# Altium schematic sheet 04 - Auxiliary Power.SchDoc: Auxiliary Power - 25kW WolfPACK FM3 Six-Pack Inv. (part 1 of 3)
size 431 x 279 mm; Date: 09/2024; DocumentNumber: CRD25DA12N-FMC; Revision: 2.0; SheetNumber: 4; SheetTotal: 9; SheetSize: B
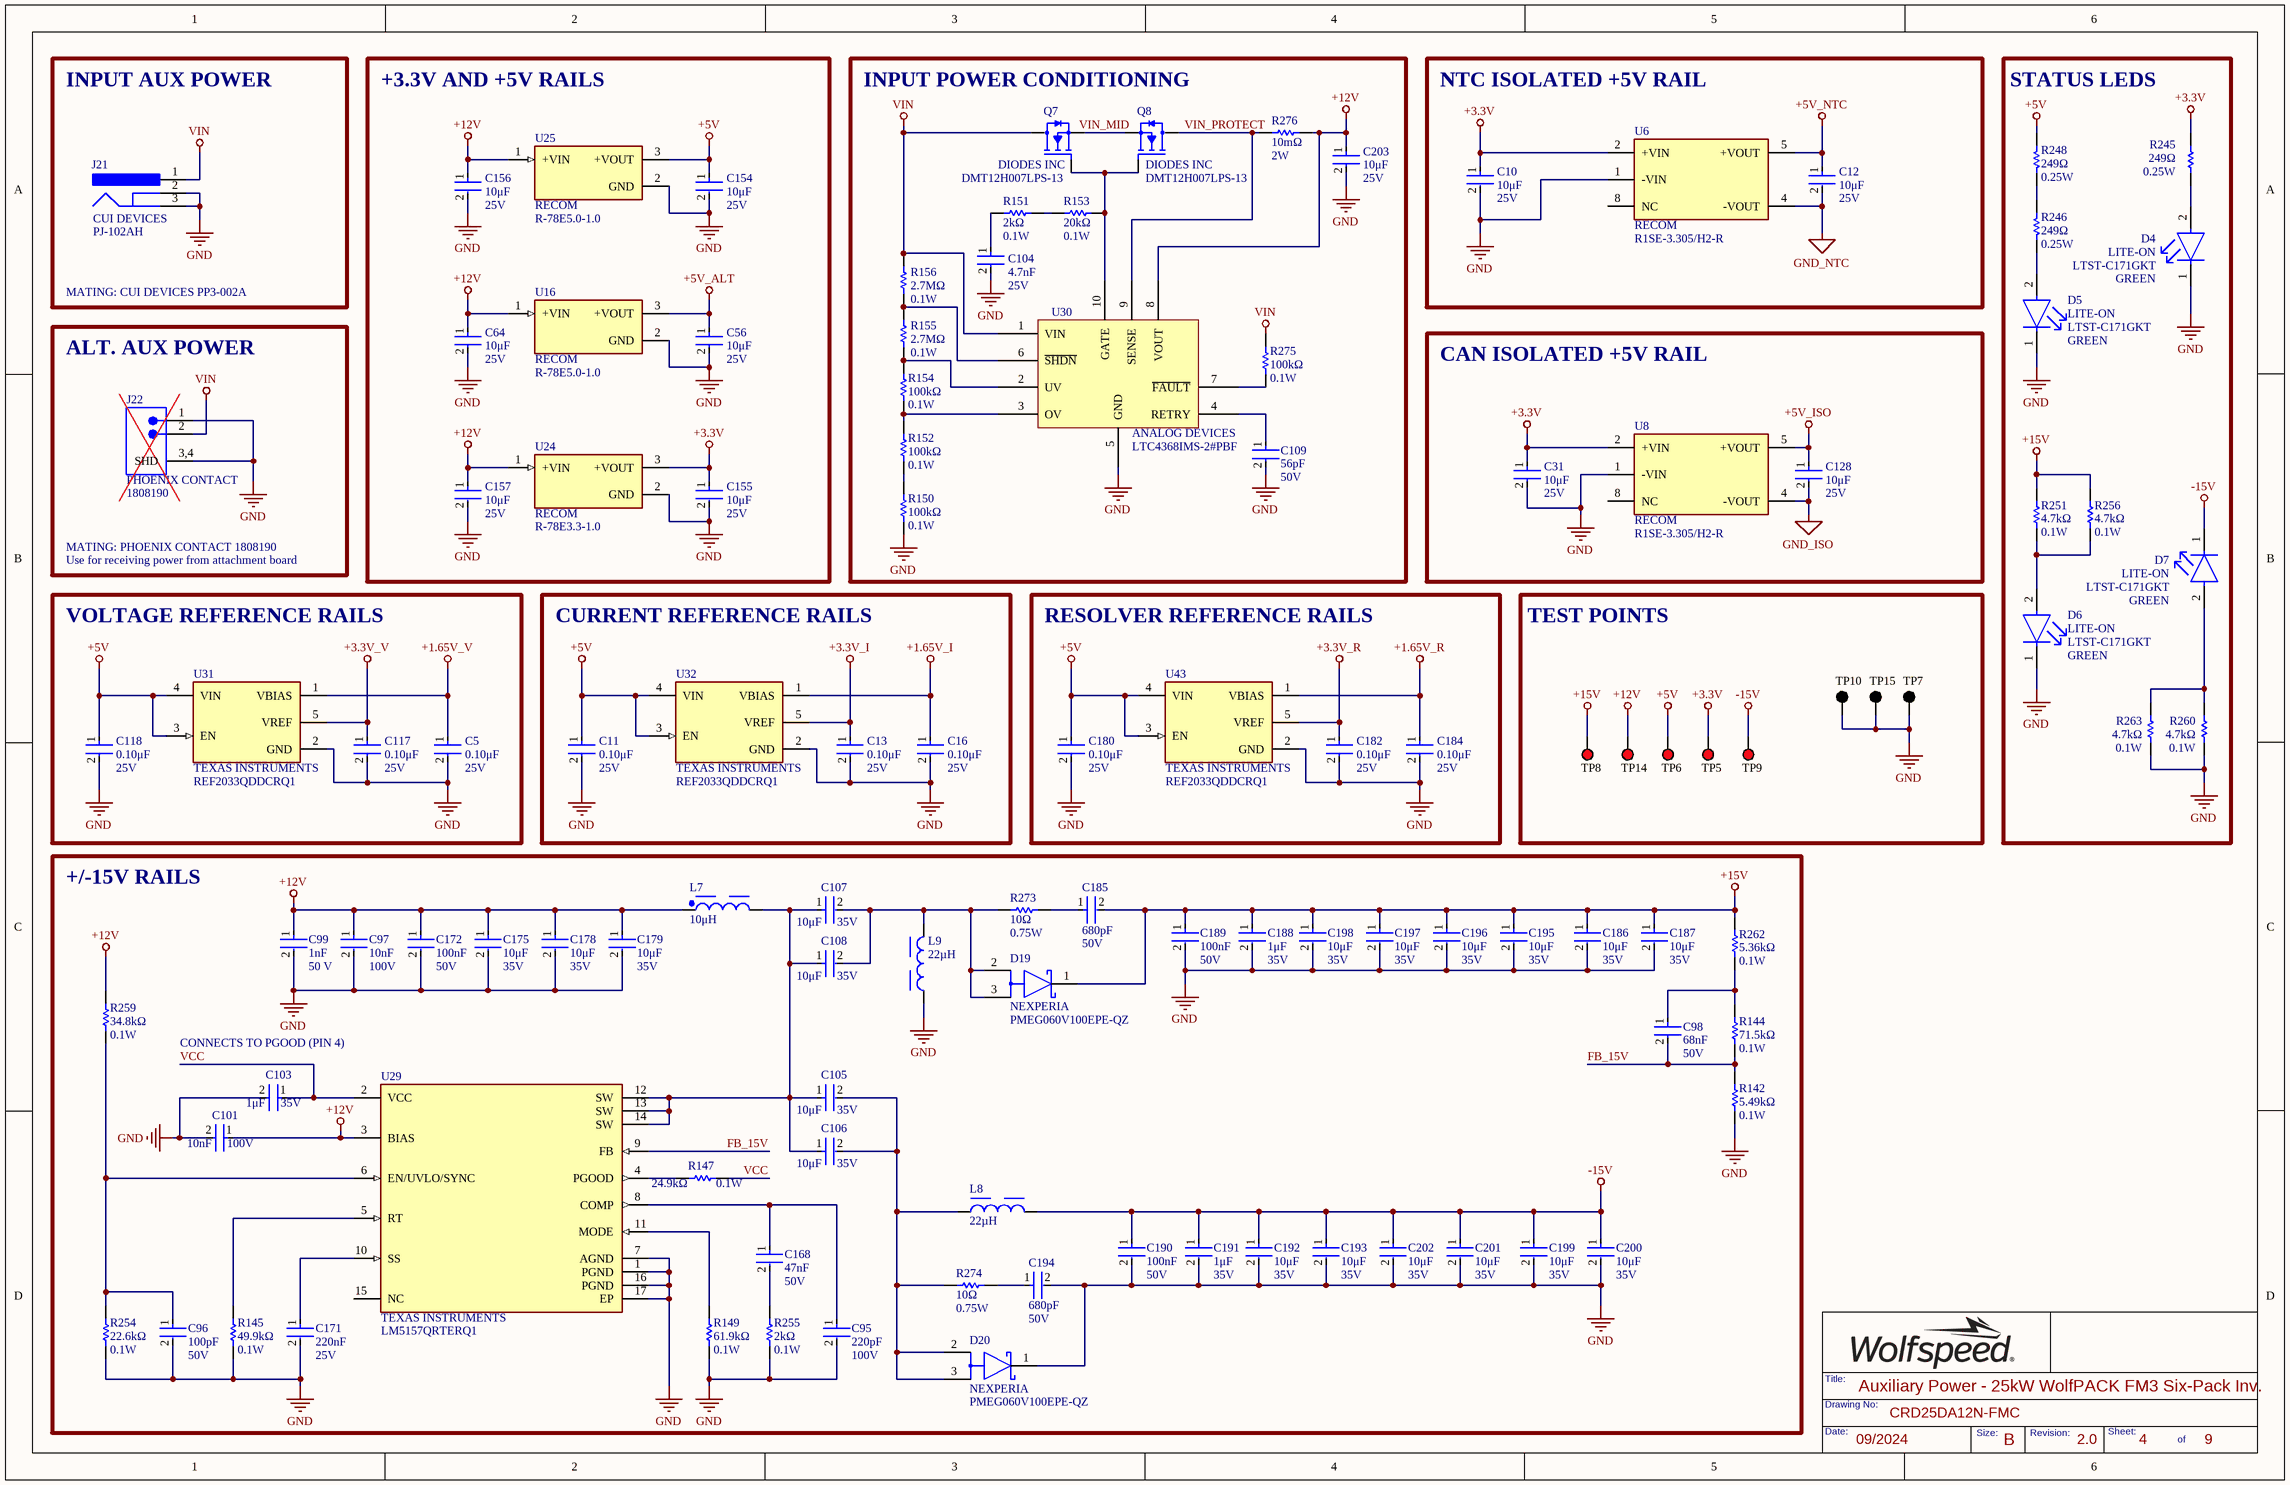
[diagram p0: 04 - Auxiliary Power.SchDoc]

## Parts
C5  Voltage Rating: 25V  Capacitance: 0.10μF  [FP-C0603C-CF-IPC_B]  (hidden comment: C0603C104K3RACTU)
C10  Voltage Rating: 25V  Capacitance: 10μF  [FP-CL31-IPC_B]  (hidden comment: CL31B106KAHSFNE)
C11  Voltage Rating: 25V  Capacitance: 0.10μF  [FP-C0603C-CF-IPC_B]  (hidden comment: C0603C104K3RACTU)
C12  Voltage Rating: 25V  Capacitance: 10μF  [FP-CL31-IPC_B]  (hidden comment: CL31B106KAHSFNE)
C13  Voltage Rating: 25V  Capacitance: 0.10μF  [FP-C0603C-CF-IPC_B]  (hidden comment: C0603C104K3RACTU)
C16  Voltage Rating: 25V  Capacitance: 0.10μF  [FP-C0603C-CF-IPC_B]  (hidden comment: C0603C104K3RACTU)
C31  Voltage Rating: 25V  Capacitance: 10μF  [FP-CL31-IPC_B]  (hidden comment: CL31B106KAHSFNE)
C56  Voltage Rating: 25V  Capacitance: 10μF  [FP-CL31-IPC_B]  (hidden comment: CL31B106KAHSFNE)
C64  Voltage Rating: 25V  Capacitance: 10μF  [FP-CL31-IPC_B]  (hidden comment: CL31B106KAHSFNE)
C95  value 220pF  Voltage Rating: 100V  [FP-C0603C-CF-IPC_B]  (hidden comment: GCM1885C2A221JA16D)
C96  Capacitance: 100pF  Voltage: 50V  [FP-C0603C-CF-IPC_B]  (hidden comment: CL10C101JB8NNNC)
C97  value 10nF  Voltage Rating: 100V  [FP-C0603C-CF-IPC_B]  (hidden comment: GCM188R72A103KA37D)
C98  value 68nF  Voltage Rating (DC): 50V  [FP-C0603C-CF-IPC_B]  (hidden comment: CGA3E2X7R1H683K080AA)
C99  Capacitance: 1nF  Voltage Rating: 50 V  [FP-C0603C-CF-IPC_B]  (hidden comment: C0603C102K5RACAUTO)
C101  value 10nF  Voltage Rating: 100V  [FP-C0603C-CF-IPC_B]  (hidden comment: GCM188R72A103KA37D)
C103  value 1μF  Voltage Rating: 35V  [FP-C0603C-CF-IPC_B]  (hidden comment: CGA3E1X7R1V105K080AC)
C104  Voltage Rating: 25V  Capacitance: 4.7nF  [FP-C0603C-CF-IPC_B]  (hidden comment: C0603C472K3RAC7867)
C105  value 10μF  Voltage Rating: 35V  [FP-C0603C-CF-IPC_B]  (hidden comment: GRM188R6YA106MA73D)
C106  value 10μF  Voltage Rating: 35V  [FP-C0603C-CF-IPC_B]  (hidden comment: GRM188R6YA106MA73D)
C107  value 10μF  Voltage Rating: 35V  [FP-C0603C-CF-IPC_B]  (hidden comment: GRM188R6YA106MA73D)
C108  value 10μF  Voltage Rating: 35V  [FP-C0603C-CF-IPC_B]  (hidden comment: GRM188R6YA106MA73D)
C109  Capacitance: 56pF  Voltage Rating: 50V  [FP-C0603C-CF-IPC_B]  (hidden comment: CL10C560JB8NNNC)
C117  Voltage Rating: 25V  Capacitance: 0.10μF  [FP-C0603C-CF-IPC_B]  (hidden comment: C0603C104K3RACTU)
C118  Voltage Rating: 25V  Capacitance: 0.10μF  [FP-C0603C-CF-IPC_B]  (hidden comment: C0603C104K3RACTU)
C128  Voltage Rating: 25V  Capacitance: 10μF  [FP-CL31-IPC_B]  (hidden comment: CL31B106KAHSFNE)
C154  Voltage Rating: 25V  Capacitance: 10μF  [FP-CL31-IPC_B]  (hidden comment: CL31B106KAHSFNE)
C155  Voltage Rating: 25V  Capacitance: 10μF  [FP-CL31-IPC_B]  (hidden comment: CL31B106KAHSFNE)
C156  Voltage Rating: 25V  Capacitance: 10μF  [FP-CL31-IPC_B]  (hidden comment: CL31B106KAHSFNE)
C157  Voltage Rating: 25V  Capacitance: 10μF  [FP-CL31-IPC_B]  (hidden comment: CL31B106KAHSFNE)
C168  value 47nF  Voltage Rating: 50V  [FP-C0603C-CF-IPC_B]  (hidden comment: CGA3E2X7R1H473K080AA)
C171  Capacitance: 220nF  Voltage: 25V  [FP-C0603C-CF-IPC_B]  (hidden comment: GCM188R71E224KA55D)
C172  value 100nF  Voltage: 50V  [FP-C0603C-CF-IPC_B]  (hidden comment: CGA3E2X7R1H104K080AA)
C175  value 10μF  Voltage Rating: 35V  [FP-C0603C-CF-IPC_B]  (hidden comment: GRM188R6YA106MA73D)
C178  value 10μF  Voltage Rating: 35V  [FP-C0603C-CF-IPC_B]  (hidden comment: GRM188R6YA106MA73D)
C179  value 10μF  Voltage Rating: 35V  [FP-C0603C-CF-IPC_B]  (hidden comment: GRM188R6YA106MA73D)
C180  Voltage Rating: 25V  Capacitance: 0.10μF  [FP-C0603C-CF-IPC_B]  (hidden comment: C0603C104K3RACTU)
C182  Voltage Rating: 25V  Capacitance: 0.10μF  [FP-C0603C-CF-IPC_B]  (hidden comment: C0603C104K3RACTU)
C184  Voltage Rating: 25V  Capacitance: 0.10μF  [FP-C0603C-CF-IPC_B]  (hidden comment: C0603C104K3RACTU)
C185  value 680pF  Voltage: 50V  [FP-C0603C-CF-IPC_B]  (hidden comment: C0603C681J5GACTU)
C186  value 10μF  Voltage Rating: 35V  [FP-C0603C-CF-IPC_B]  (hidden comment: GRM188R6YA106MA73D)
C187  value 10μF  Voltage Rating: 35V  [FP-C0603C-CF-IPC_B]  (hidden comment: GRM188R6YA106MA73D)
C188  value 1μF  Voltage Rating: 35V  [FP-C0603C-CF-IPC_B]  (hidden comment: CGA3E1X7R1V105K080AC)
C189  value 100nF  Voltage: 50V  [FP-C0603C-CF-IPC_B]  (hidden comment: CGA3E2X7R1H104K080AA)
C190  value 100nF  Voltage: 50V  [FP-C0603C-CF-IPC_B]  (hidden comment: CGA3E2X7R1H104K080AA)
C191  value 1μF  Voltage Rating: 35V  [FP-C0603C-CF-IPC_B]  (hidden comment: CGA3E1X7R1V105K080AC)
C192  value 10μF  Voltage Rating: 35V  [FP-C0603C-CF-IPC_B]  (hidden comment: GRM188R6YA106MA73D)
C193  value 10μF  Voltage Rating: 35V  [FP-C0603C-CF-IPC_B]  (hidden comment: GRM188R6YA106MA73D)
C194  value 680pF  Voltage: 50V  [FP-C0603C-CF-IPC_B]  (hidden comment: C0603C681J5GACTU)
C195  value 10μF  Voltage Rating: 35V  [FP-C0603C-CF-IPC_B]  (hidden comment: GRM188R6YA106MA73D)
C196  value 10μF  Voltage Rating: 35V  [FP-C0603C-CF-IPC_B]  (hidden comment: GRM188R6YA106MA73D)
C197  value 10μF  Voltage Rating: 35V  [FP-C0603C-CF-IPC_B]  (hidden comment: GRM188R6YA106MA73D)
C198  value 10μF  Voltage Rating: 35V  [FP-C0603C-CF-IPC_B]  (hidden comment: GRM188R6YA106MA73D)
C199  value 10μF  Voltage Rating: 35V  [FP-C0603C-CF-IPC_B]  (hidden comment: GRM188R6YA106MA73D)
C200  value 10μF  Voltage Rating: 35V  [FP-C0603C-CF-IPC_B]  (hidden comment: GRM188R6YA106MA73D)
C201  value 10μF  Voltage Rating: 35V  [FP-C0603C-CF-IPC_B]  (hidden comment: GRM188R6YA106MA73D)
C202  value 10μF  Voltage Rating: 35V  [FP-C0603C-CF-IPC_B]  (hidden comment: GRM188R6YA106MA73D)
C203  Voltage Rating: 25V  Capacitance: 10μF  [FP-CL31-IPC_B]  (hidden comment: CL31B106KAHSFNE)
D4  value GREEN  Manufacturer: LITE-ON  [FP-LTST-C171GKT-MFG]  (hidden comment: LTST-C171GKT)
D5  value GREEN  Manufacturer: LITE-ON  [FP-LTST-C171GKT-MFG]  (hidden comment: LTST-C171GKT)
D6  value GREEN  Manufacturer: LITE-ON  [FP-LTST-C171GKT-MFG]  (hidden comment: LTST-C171GKT)
D7  value GREEN  Manufacturer: LITE-ON  [FP-LTST-C171GKT-MFG]  (hidden comment: LTST-C171GKT)
D19  Manufacturer: NEXPERIA  [FP-PSMC_TO-277A-MFG]  (hidden comment: PMEG060V100EPE-QZ)
D20  Manufacturer: NEXPERIA  [FP-PSMC_TO-277A-MFG]  (hidden comment: PMEG060V100EPE-QZ)
J21  PJ-102AH  Manufacturer Print: CUI DEVICES  [CUI-PJ-102B_V]
J22  Manufacturer: PHOENIX CONTACT  [1808190]  (hidden comment: 1808190)
L7  value 10μH  [WE-XHMI_8080_L8.8W8.3H7.8]  (hidden comment: 74439358100)
L8  value 22µH  [74437368220]  (hidden comment: 74437368220)
L9  value 22µH  [74437368220]  (hidden comment: 74437368220)
Q7  DMT12H007LPS-13  Manufacturer: DIODES INC  [FP-PowerDI5060-8-MFG]
Q8  DMT12H007LPS-13  Manufacturer: DIODES INC  [FP-PowerDI5060-8-MFG]
R142  value 5.49kΩ  Power Rating: 0.1W  [FP-MCR03-IPC_B]  (hidden comment: RC0603FR-075K49L)
R144  value 71.5kΩ  Max Power Dissipation: 0.1W  [FP-MCR03-IPC_B]  (hidden comment: RT0603DRE0771K5L)
R145  value 49.9kΩ  Power Rating: 0.1W  [FP-MCR03-IPC_B]  (hidden comment: RT0603FRE0749K9L)
R147  value 24.9kΩ  Power Rating: 0.1W  [FP-MCR03-IPC_B]  (hidden comment: RC0603FR-0724K9L)
R149  value 61.9kΩ  Power Rating: 0.1W  [FP-MCR03-IPC_B]  (hidden comment: RC0603FR-0761K9L)
R150  Resistance: 100kΩ  Power Rating: 0.1W  [FP-MCR03-IPC_B]  (hidden comment: RC0603FR-07100KL)
R151  Resistance: 2kΩ  Power Rating: 0.1W  [FP-MCR03-IPC_B]  (hidden comment: RT0603DRE072KL)
R152  Resistance: 100kΩ  Power Rating: 0.1W  [FP-MCR03-IPC_B]  (hidden comment: RC0603FR-07100KL)
R153  Resistance: 20kΩ  Power Rating: 0.1W  [FP-MCR03-IPC_B]  (hidden comment: CRCW060320K0FKTA)
R154  Resistance: 100kΩ  Power Rating: 0.1W  [FP-MCR03-IPC_B]  (hidden comment: RC0603FR-07100KL)
R155  Power Rating: 0.1W  Resistance: 2.7MΩ  [FP-MCR03-IPC_B]  (hidden comment: RC0603JR-072M7L)
R156  Power Rating: 0.1W  Resistance: 2.7MΩ  [FP-MCR03-IPC_B]  (hidden comment: RC0603JR-072M7L)
R245  Resistance: 249Ω  Power Rating: 0.25W  [FP-MCR18-IPC_A]  (hidden comment: RC1206FR-07249RL)
R246  Resistance: 249Ω  Power Rating: 0.25W  [FP-MCR18-IPC_A]  (hidden comment: RC1206FR-07249RL)
R248  Resistance: 249Ω  Power Rating: 0.25W  [FP-MCR18-IPC_A]  (hidden comment: RC1206FR-07249RL)
R251  Resistance: 4.7kΩ  Power Rating: 0.1W  [FP-MCR03-IPC_B]  (hidden comment: CRCW06034K70FKTA)
R254  value 22.6kΩ  Max Power Dissipation: 0.1W  [FP-MCR03-IPC_B]  (hidden comment: RT0603DRE0722K6L)
R255  Resistance: 2kΩ  Power Rating: 0.1W  [FP-MCR03-IPC_B]  (hidden comment: RT0603DRE072KL)
R256  Resistance: 4.7kΩ  Power Rating: 0.1W  [FP-MCR03-IPC_B]  (hidden comment: CRCW06034K70FKTA)
R259  value 34.8kΩ  Power Rating: 0.1W  [FP-MCR03-IPC_B]  (hidden comment: RT0603DRE0734K8L)
R260  Resistance: 4.7kΩ  Power Rating: 0.1W  [FP-MCR03-IPC_B]  (hidden comment: CRCW06034K70FKTA)
R262  value 5.36kΩ  Power Rating: 0.1W  [FP-MCR03-IPC_B]  (hidden comment: RT0603BRD075K36L)
R263  Resistance: 4.7kΩ  Power Rating: 0.1W  [FP-MCR03-IPC_B]  (hidden comment: CRCW06034K70FKTA)
R273  value 10Ω  Power Rating: 0.75W  [RESC3125X70X40NL20T20]  (hidden comment: CRCW121010R0FKEAHP)
R274  value 10Ω  Power Rating: 0.75W  [RESC3125X70X40NL20T20]  (hidden comment: CRCW121010R0FKEAHP)
R275  Resistance: 100kΩ  Power Rating: 0.1W  [FP-MCR03-IPC_B]  (hidden comment: RC0603FR-07100KL)
R276  Resistance: 10mΩ  Max Power Dissipation: 2W  [FP-RL2512-IPC_A]  (hidden comment: PE2512FKE7W0R01L)
TP5  5010  [KSTN-5010_V]  (value not drawn)
TP6  5010  [KSTN-5010_V]  (value not drawn)
TP7  5011  [KSTN-5011_V]  (value not drawn)
TP8  5010  [KSTN-5010_V]  (value not drawn)
TP9  5010  [KSTN-5010_V]  (value not drawn)
TP10  5011  [KSTN-5011_V]  (value not drawn)
TP14  5010  [KSTN-5010_V]  (value not drawn)
TP15  5011  [KSTN-5011_V]  (value not drawn)
U6  Manufacturer: RECOM  [FP-R1SE-0505-R-MFG]  (hidden comment: R1SE-3.305/H2-R)
U8  Manufacturer: RECOM  [FP-R1SE-0505-R-MFG]  (hidden comment: R1SE-3.305/H2-R)
U16  R-78E5.0-1.0  Manufacturer Print: RECOM  [CONV_R-78E5.0-1.0]
U24  R-78E3.3-1.0  Manufacturer Print: RECOM  [CONV_R-78E3.3-1.0]
U25  R-78E5.0-1.0  Manufacturer Print: RECOM  [CONV_R-78E5.0-1.0]
U29  Manufacturer: TEXAS INSTRUMENTS  [FP-RTE0016K-IPC_A]  (hidden comment: LM5157QRTERQ1)
U30  LTC4368IMS-2#PBF  Manufacturer Print: ANALOG DEVICES  [SOP50P490X110-10N]
U31  Manufacturer: TEXAS INSTRUMENTS  [FP-DDC0005A-MFG]  (hidden comment: REF2033QDDCRQ1)
U32  Manufacturer: TEXAS INSTRUMENTS  [FP-DDC0005A-MFG]  (hidden comment: REF2033QDDCRQ1)
U43  Manufacturer: TEXAS INSTRUMENTS  [FP-DDC0005A-MFG]  (hidden comment: REF2033QDDCRQ1)

## Blocks framed on the sheet
INPUT AUX POWER: J21
+3.3V AND +5V RAILS: C56 C64 C154-C157 U16 U24 U25
INPUT POWER CONDITIONING: C104 C109 C203 Q7 Q8 R150-R156 R275 R276 U30
NTC ISOLATED +5V RAIL: C10 C12 U6
STATUS LEDS: D4-D7 R245 R246 R248 R251 R256 R260 R263
ALT. AUX POWER: J22
CAN ISOLATED +5V RAIL: C31 C128 U8
VOLTAGE REFERENCE RAILS: C5 C117 C118 U31
CURRENT REFERENCE RAILS: C11 C13 C16 U32
RESOLVER REFERENCE RAILS: C180 C182 C184 U43
TEST POINTS: TP5-TP10 TP14 TP15
+/-15V RAILS: C95-C99 C101 C103 C105-C108 C168 C171 C172 C175 C178 C179 C185-C202 D19 D20 L7-L9 R142 R144 R145 R147 R149 R254 R255 R259 R262 R273 R274 U29

## Nets
+1.65V_I: C16.1 U32.1(VBIAS)
+1.65V_R: C184.1 U43.1(VBIAS)
+1.65V_V: C5.1 U31.1(VBIAS)
+3.3V: C10.1 C31.1 C155.1 R245.1 TP5.1 U6.2(+VIN) U8.2(+VIN) U24.3(+VOUT)
+3.3V_I: C13.1 U32.5(VREF)
+3.3V_R: C182.1 U43.5(VREF)
+3.3V_V: C117.1 U31.5(VREF)
+5V: C11.1 C118.1 C154.1 C180.1 R248.1 TP6.1 U25.3(+VOUT) U31.3(EN) U31.4(VIN) U32.3(EN) U32.4(VIN) U43.3(EN) U43.4(VIN)
+5V_ALT: C56.1 U16.3(+VOUT)
+5V_ISO: C128.1 U8.5(+VOUT)
+5V_NTC: C12.1 U6.5(+VOUT)
+12V: C64.1 C97.1 C99.1 C101.1 C156.1 C157.1 C172.1 C175.1 C178.1 C179.1 C203.1 L7.1 R259.2 R276.2 TP14.1 U16.1(+VIN) U24.1(+VIN) U25.1(+VIN) U29.3(BIAS) U30.8(VOUT)
+15V: C185.2 C186.1 C187.1 C188.1 C189.1 C195.1 C196.1 C197.1 C198.1 D19.1(K) R251.2 R256.2 R262.2 TP8.1
-15V: C190.1 C191.1 C192.1 C193.1 C199.1 C200.1 C201.1 C202.1 D7.1(C) L8.2 TP9.1
GND: C5.2 C10.2 C11.2 C13.2 C16.2 C31.2 C56.2 C64.2 C95.2 C96.2 C97.2 C99.2 C101.2 C103.2 C104.2 C109.2 C117.2 C118.2 C154.2 C155.2 C156.2 C157.2 C171.2 C172.2 C175.2 C178.2 C179.2 C180.2 C182.2 C184.2 C186.2 C187.2 C188.2 C189.2 C190.2 C191.2 C192.2 C193.2 C194.2 C195.2 C196.2 C197.2 C198.2 C199.2 C200.2 C201.2 C202.2 C203.2 D4.1(C) D5.1(C) D6.1(C) D20.1(K) J21.2 J21.3 J22.1 J22.3,4(SHD) L9.1 R142.1 R145.1 R149.1 R150.1 R254.1 R255.1 R260.1 R263.1 TP7.1 TP10.1 TP15.1 U6.1(-VIN) U8.1(-VIN) U16.2(GND) U24.2(GND) U25.2(GND) U29.1(PGND) U29.7(AGND) U29.16(PGND) U29.17(EP) U30.5(GND) U31.2(GND) U32.2(GND) U43.2(GND)
GND_ISO: C128.2 U8.4(-VOUT)
GND_NTC: C12.2 U6.4(-VOUT)
VIN: J21.1 J22.2 Q7.5(D) R156.2 R275.2 U30.1(VIN)
FB_15V: C98.2 R142.2 R144.1 U29.9(FB)
VCC: C103.1 R147.2 U29.2(VCC)
VIN_MID: Q7.1,2,3(S) Q8.1,2,3(S)
VIN_PROTECT: Q8.5(D) R276.1 U30.9(SENSE)
NetC95_1: C95.1 C168.1 U29.8(COMP)
NetC96_1: C96.1 R254.2 R259.1 U29.6(EN/UVLO/SYNC)
NetC98_1: C98.1 R144.2 R262.1
NetC104_1: C104.1 R151.1
NetC105_1: C105.1 C106.1 C107.1 C108.1 L7.2 U29.12(SW) U29.13(SW) U29.14(SW)
NetC105_2: C105.2 C106.2 D20.2(A) D20.3(A) L8.1 R274.1
NetC107_2: C107.2 C108.2 D19.2(A) D19.3(A) L9.2 R273.1
NetC109_1: C109.1 U30.4(RETRY)
NetC168_2: C168.2 R255.2
NetC171_1: C171.1 U29.10(SS)
NetC185_1: C185.1 R273.2
NetC194_1: C194.1 R274.2
NetD4_2: D4.2(A) R245.2
NetD5_2: D5.2(A) R246.2
NetD6_2: D6.2(A) R251.1 R256.1
NetD7_2: D7.2(A) R260.2 R263.2
NetQ7_4: Q7.4(G) Q8.4(G) R153.2 U30.10(GATE)
NetR145_2: R145.2 U29.5(RT)
NetR147_1: R147.1 U29.4(PGOOD)
NetR149_2: R149.2 U29.11(MODE)
NetR150_2: R150.2 R152.1
NetR151_2: R151.2 R153.1
NetR152_2: R152.2 R154.1 U30.3(OV)
NetR154_2: R154.2 R155.1 U30.2(UV)
NetR155_2: R155.2 R156.1 U30.6(~{SHDN})
NetR246_1: R246.1 R248.2
NetR275_1: R275.1 U30.7(~{FAULT})

Not connected (* = marked no-connect by the designer): U6 8(NC); U8 8(NC); U29 15(NC)

## Notes on the sheet
- MATING: CUI DEVICES PP3-002A
- MATING: PHOENIX CONTACT 1808190
- Use for receiving power from attachment board
- CONNECTS TO PGOOD (PIN 4)
- Title:
- Date:
- Drawing No:
- Size:
- Revision:
- Sheet:
- of